# EasyEDA schematic Atmega8 VAW screen (easyEDA source).json
TITLE: VAW_meter; REV: 1.0; Date: 2020-02-17; Sheet: 1/1; Drawn By: Dima_Ses; Company: Your Company
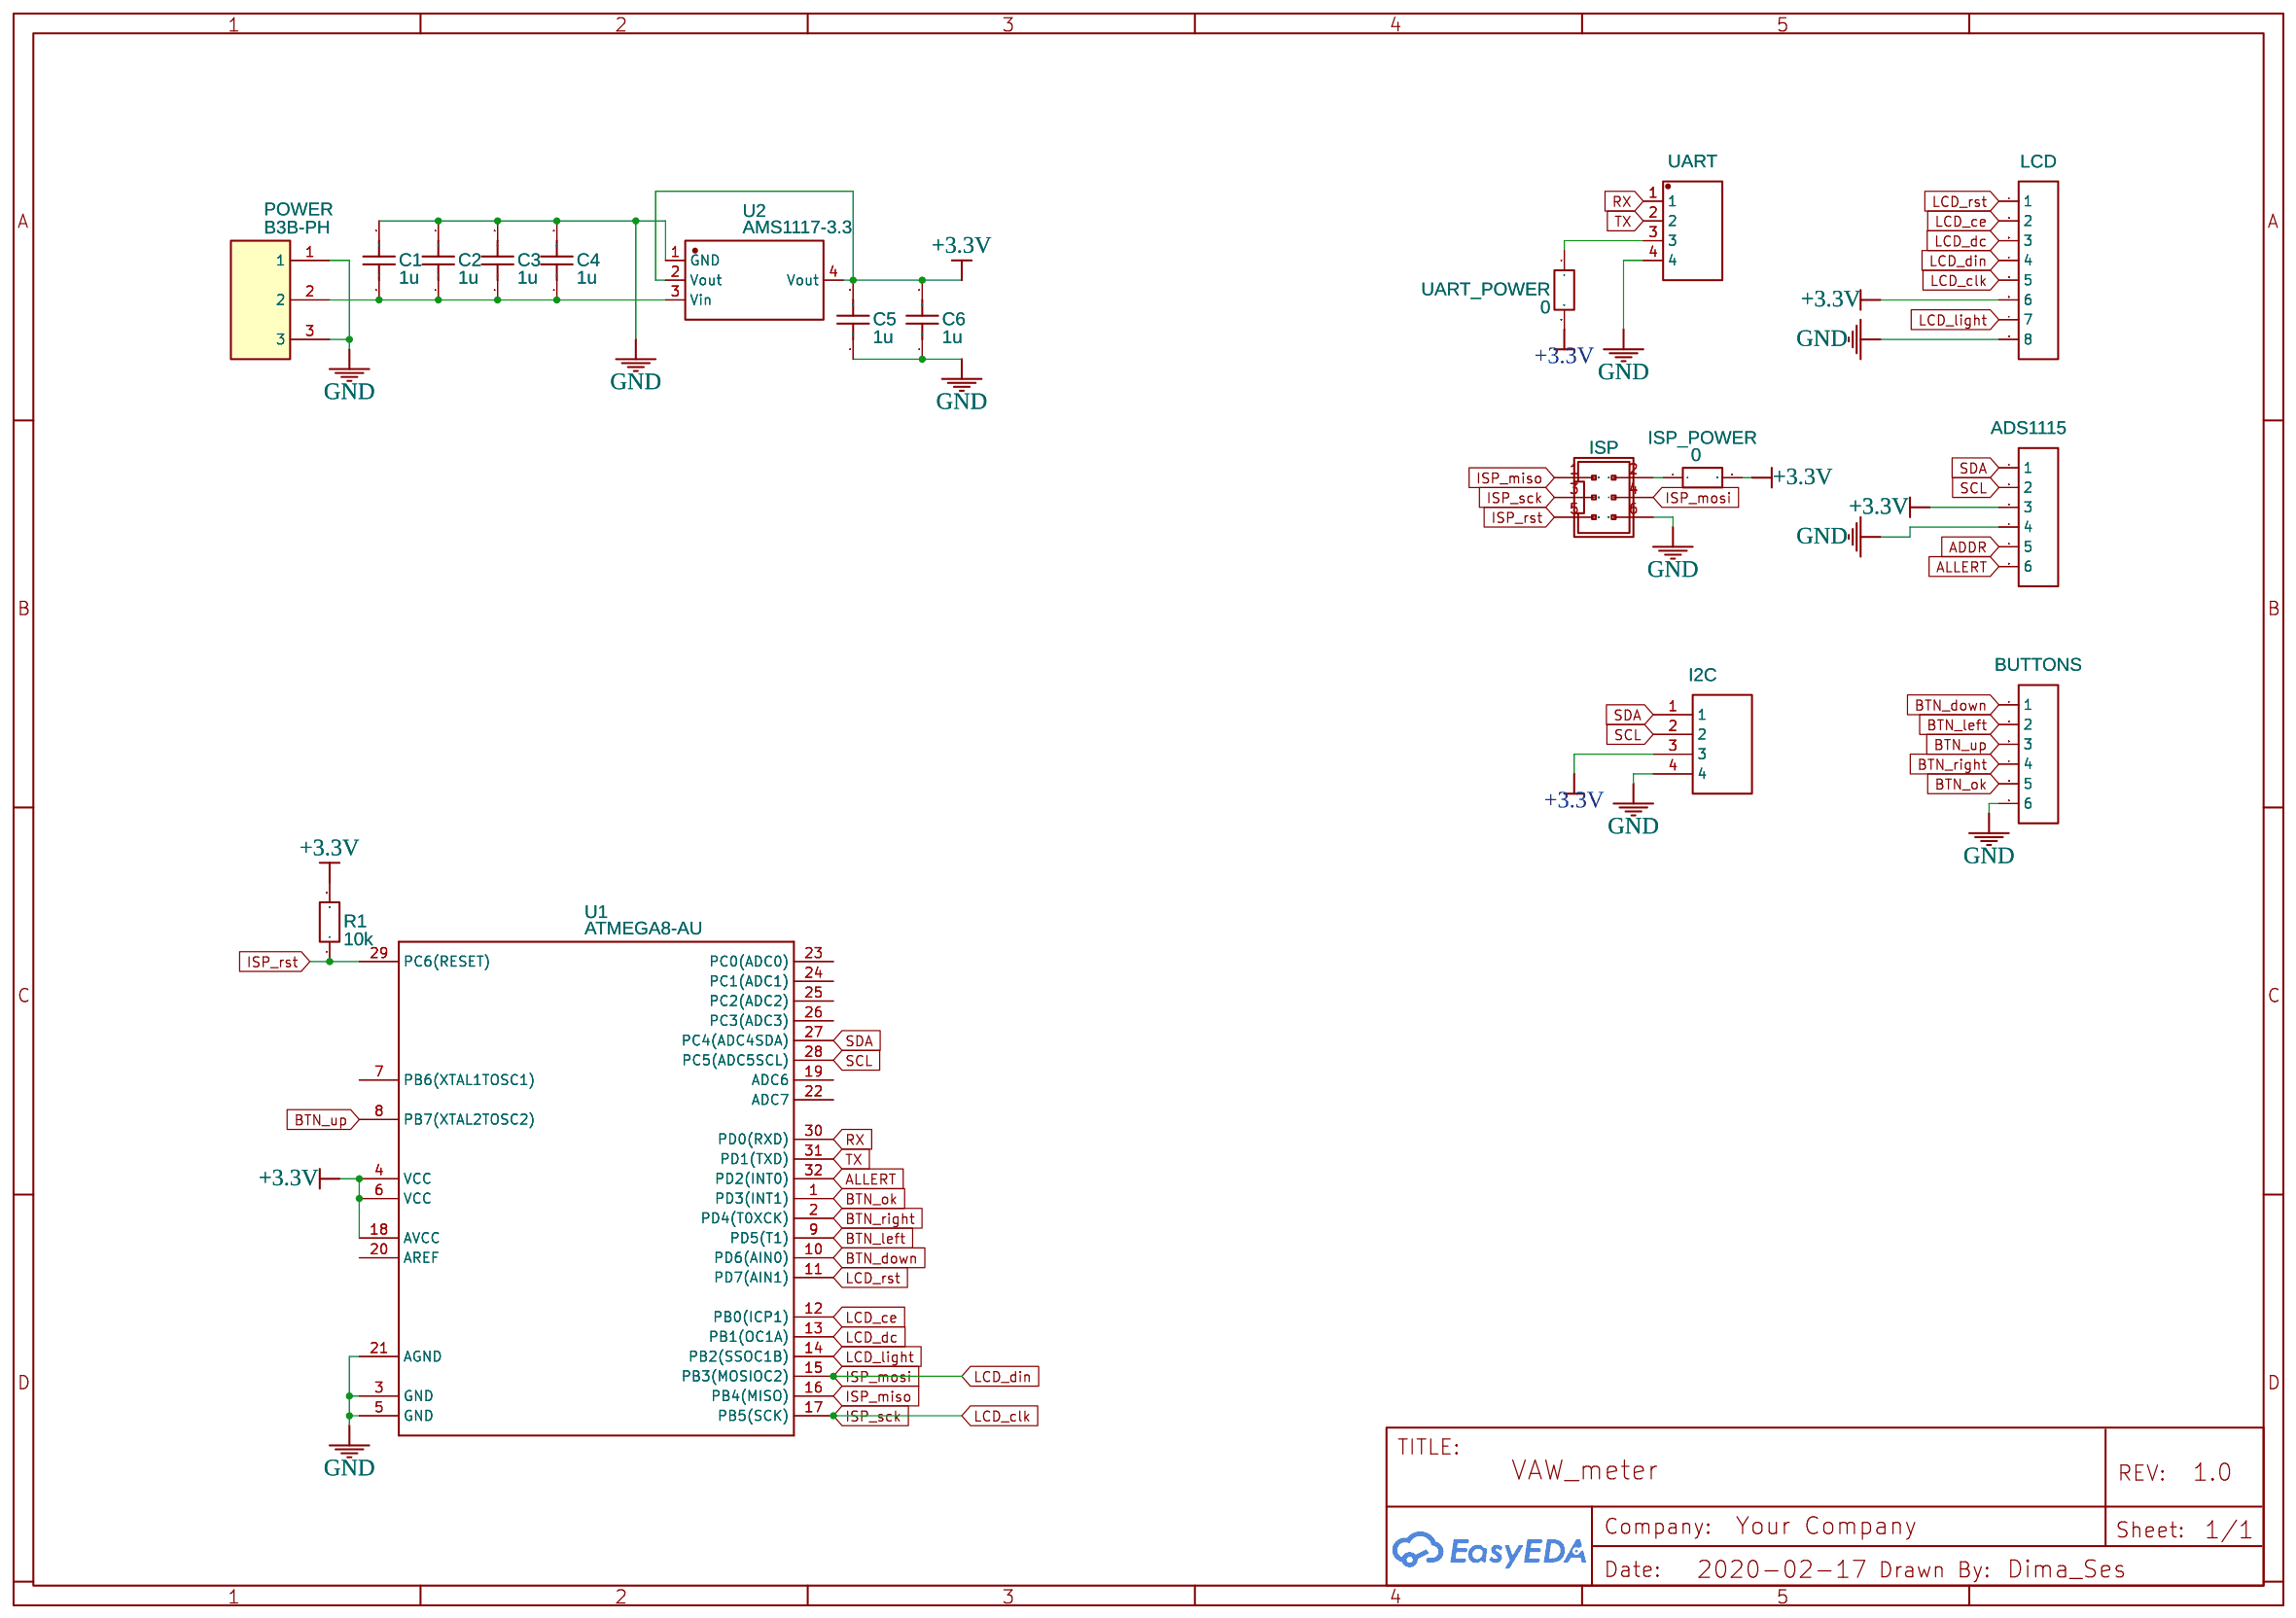
[diagram p0: schematic sheet]

## Parts
ADS1115  ADS1115  [HDR-TH_6P-P2.54-V]
BUTTONS  Header-Male-2.54_1x6  [HDR-TH_6P-P2.54-V]
C1  1u  [1206]
C2  1u  [1206]
C3  1u  [1206]
C4  1u  [1206]
C5  1u  [1206]
C6  1u  [C0805]
I2C  220S-1*4P H=8.5MM Ytype Gold-plated  [DIP-1X4P2.54]
ISP  BH-06  [BH-06]
ISP_POWER  0  [0805]
LCD  Header-Female-2.54_1x8  [HDR-8X1/2.54]
POWER  B3B-PH  [CONN-TH_B3B-PH-K-S]
R1  10k  [0805]
U1  ATMEGA8-AU  [TQFP32-08]
U2  AMS1117-3.3  [SOT-223-3_L6.5-W3.4-P2.30-LS7.0-BR]
UART  UART  [DIP-1X4P-2.54MM-M]
UART_POWER  0  [0805]

## Library data of the parts
ADS1115 BUTTONS = Header-Male-2.54_1x6: Supplier: LCSC; Manufacturer: BOOMELE; Supplier Part: C37208
C1-C6 = Cap_1206_US
I2C = 220S-1*4P H=8.5MM Ytype Gold-plated: Supplier: LCSC; Manufacturer: Ckmtw; Contributor: LCSC; Supplier Part: C124413
ISP = BH-06: Manufacturer: Connfly; Supplier Part: BH-14R; Contributor: alexey.khozin
ISP_POWER R1 UART_POWER = Res_0805(1/8W)_EU
LCD = Header-Female-2.54_1x8: Supplier: LCSC; Manufacturer: BOOMELE; Manufacturer Part: Female headerHDR1X8-2.54; Supplier Part: C27438
POWER = B3B-PH-K-S(LF)(SN): Supplier: LCSC; Manufacturer: JST; Contributor: LCSC; Supplier Part: C131339
U1 = ATMEGA8-AU
U2 = AMS1117-3.3: sourceId: dwIGgezVh; Supplier: LCSC; Manufacturer: AMS; LCSC Assembly: Yes; image: //image.lceda.cn/szlcsc/C6186.jpg; Supplier Part: C6186; SMT Type: Basic
UART = Header-Male-2.54_1x4: Supplier: LCSC; Manufacturer: Ckmtw; Manufacturer Part: 210S-1*4P L=11.6MMGold-plated black; Contributor: LCSC; Supplier Part: C124378

## Nets
+3.3V: ADS1115.3 C5.2 C6.2 I2C.3 ISP_POWER.2 LCD.6 R1.2 U1.4(VCC) U1.6(VCC) U1.18(AVCC) U2.2(Vout) U2.4(Vout) UART_POWER.2
GND: ADS1115.4 BUTTONS.6 C1.2 C2.2 C3.2 C4.2 C5.1 C6.1 I2C.4 ISP.6 LCD.8 POWER.1 POWER.3 U1.3(GND) U1.5(GND) U1.21(AGND) U2.1(GND) UART.4
ADDR: ADS1115.5
ALLERT: ADS1115.6 U1.32(PD2(INT0))
BTN_down: BUTTONS.1 U1.10(PD6(AIN0))
BTN_left: BUTTONS.2 U1.9(PD5(T1))
BTN_ok: BUTTONS.5 U1.1(PD3(INT1))
BTN_right: BUTTONS.4 U1.2(PD4(T0XCK))
BTN_up: BUTTONS.3 U1.8(PB7(XTAL2TOSC2))
ISP_miso: ISP.1 U1.16(PB4(MISO))
ISP_mosi: ISP.4 LCD.4 U1.15(PB3(MOSIOC2))
ISP_rst: ISP.5 R1.1 U1.29(PC6(RESET))
ISP_sck: ISP.3 LCD.5 U1.17(PB5(SCK))
LCD_ce: LCD.2 U1.12(PB0(ICP1))
LCD_dc: LCD.3 U1.13(PB1(OC1A))
LCD_light: LCD.7 U1.14(PB2(SSOC1B))
LCD_rst: LCD.1 U1.11(PD7(AIN1))
RX: U1.30(PD0(RXD)) UART.1
SCL: ADS1115.2 I2C.2 U1.28(PC5(ADC5SCL))
SDA: ADS1115.1 I2C.1 U1.27(PC4(ADC4SDA))
TX: U1.31(PD1(TXD)) UART.2
Net-(C1-1): C1.1 C2.1 C3.1 C4.1 POWER.2 U2.3(Vin)
Net-(ISP-2): ISP.2 ISP_POWER.1
Net-(UART-3): UART.3 UART_POWER.1

Not connected (* = marked no-connect by the designer): U1 7(PB6(XTAL1TOSC1)) 19(ADC6) 20(AREF) 22(ADC7) 23(PC0(ADC0)) 24(PC1(ADC1)) 25(PC2(ADC2)) 26(PC3(ADC3))
